# Altium schematic sheet Sheet1.SchDoc
size A4
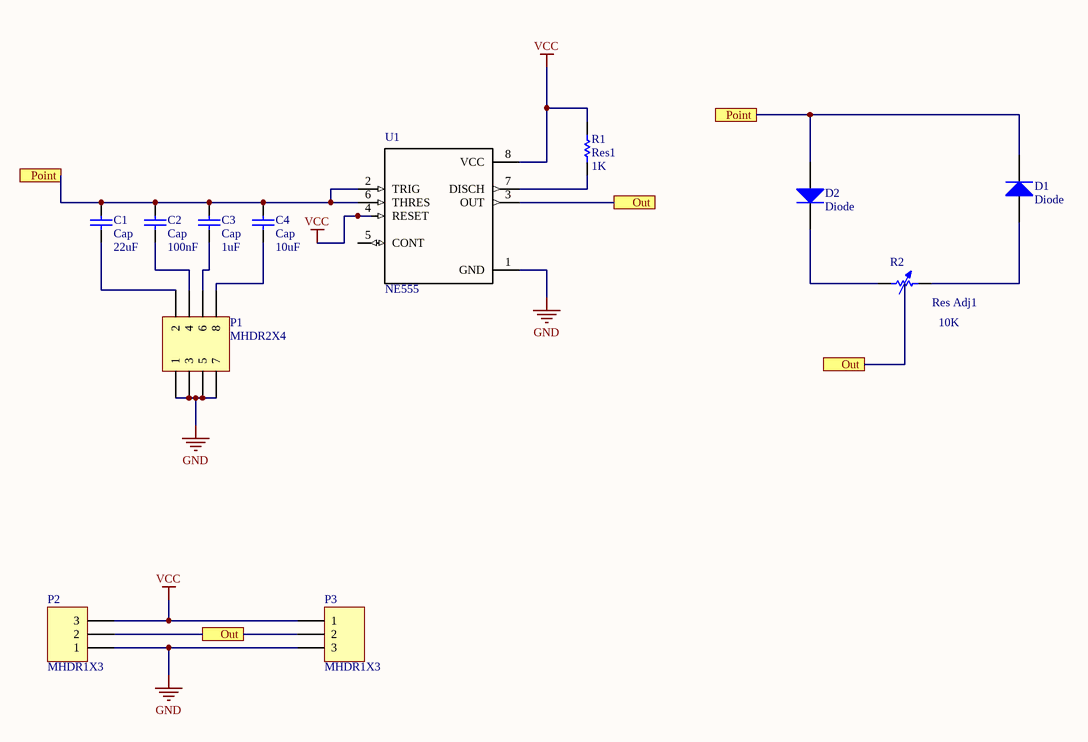
[diagram p0: Sheet1.SchDoc]

## Parts
C1  Cap  value 22uF  [RAD-0.3]
C2  Cap  value 100nF  [RAD-0.3]
C3  Cap  value 1uF  [RAD-0.3]
C4  Cap  value 10uF  [RAD-0.3]
D1  Diode  [DIODE-0.4]
D2  Diode  [DIODE-0.4]
P1  MHDR2X4  [HEADER_2X4]
P2  MHDR1X3  [HEADER_1X3]
P3  MHDR1X3  [CN_KRE_3]
R1  Res1  value 1K  [AXIAL-0.3]
R2  Res Adj1  value 10K  [CN_KRE_3]
U1  NE555  [*DIP794W45P254L1060H508Q8]

## Ports
Out, Point

## Nets
GND: P1.1 P1.3 P1.5 P1.7 P2.1 P3.3 U1.1(GND)
VCC: P2.3 P3.1 R1.2 U1.4(RESET) U1.8(VCC)
Out: P2.2 P3.2 U1.3(OUT) ; port Out
Point: C1.2 C2.2 C3.2 C4.2 D1.2(K) D2.1(A) U1.2(TRIG) U1.6(THRES) ; port Point
NetC1_1: C1.1 P1.2
NetC2_1: C2.1 P1.4
NetC3_1: C3.1 P1.6
NetC4_1: C4.1 P1.8
NetD1_1: D1.1(A) R2.2
NetD2_2: D2.2(K) R2.1
NetR1_1: R1.1 U1.7(DISCH)

Not connected (* = marked no-connect by the designer): U1 5(CONT)

## Library data of the parts
C1-C4 = Cap: Capacitor; Published: 8-Jun-2000; LatestRevisionDate: 17-Jul-2002; LatestRevisionNote: Re-released for DXP Platform.; PackageReference: RAD-0.3; Publisher: Altium Limited; PackageDescription: Radial Cap, Thru-Hole; 2 Leads; 0.3 in Pin Spacing
D1 D2 = Diode: Default Diode; Published: 8-Jun-2000; LatestRevisionDate: 17-Jul-2002; LatestRevisionNote: Re-released for DXP Platform.; PackageVersion: Sep-1996; PackageReference: SMC; Publisher: Altium Limited; PackageDescription: DO-214-AB/SMC; 2 C-Bend Leads; Body 7.9 x 5.9 mm, inc. leads (LxW); Code_JEDEC: DO-214-AB
P1 = MHDR2X4: Header, 4-Pin, Dual row; LatestRevisionDate: 17-Jul-2002; LatestRevisionNote: Re-released for DXP Platform.; Publisher: Altium Limited
P2 P3 = MHDR1X3: Header, 3-Pin; LatestRevisionDate: 17-Jul-2002; LatestRevisionNote: Re-released for DXP Platform.; Publisher: Altium Limited
R1 = Res1: Resistor; Published: 8-Jun-2000; LatestRevisionDate: 17-Jul-2002; LatestRevisionNote: Re-released for DXP Platform.; PackageReference: AXIAL-0.3; Publisher: Altium Limited; PackageDescription: Axial Device, Thru-Hole; 2 Leads; 0.3 in Pin Spacing
R2 = Res Adj1: Variable Resistor; Set Position: 0.5; Published: 8-Jun-2000; LatestRevisionDate: 17-Jul-2002; LatestRevisionNote: Re-released for DXP Platform.; PackageReference: AXIAL-0.7; Publisher: Altium Limited; PackageDescription: Axial Device, Thru-Hole; 2 Leads; 0.7 in Pin Spacing
U1 = NE555: MF: Texas Instruments; MP: NE555; SnapEDA_Link: https://www.snapeda.com/parts/NE555/Texas%20Instruments/view-part/?ref=snap; Package: SOIC-8 Conrad; Digi-Key_Part_Number: 296-6501-1-ND; Digi-Key_Purchase_URL: https://www.digikey.com.br/product-detail/en/texas-instruments/NE555DR/296-6501-1-ND/372490?utm_source=snapeda&utm_medium=aggregator&utm_campaign=symbol; Value: *